# EAGLE schematic Pack Supervisor 97x127mm Rev B (EAGLE 7.2.0)

## Sheet 1 of 2
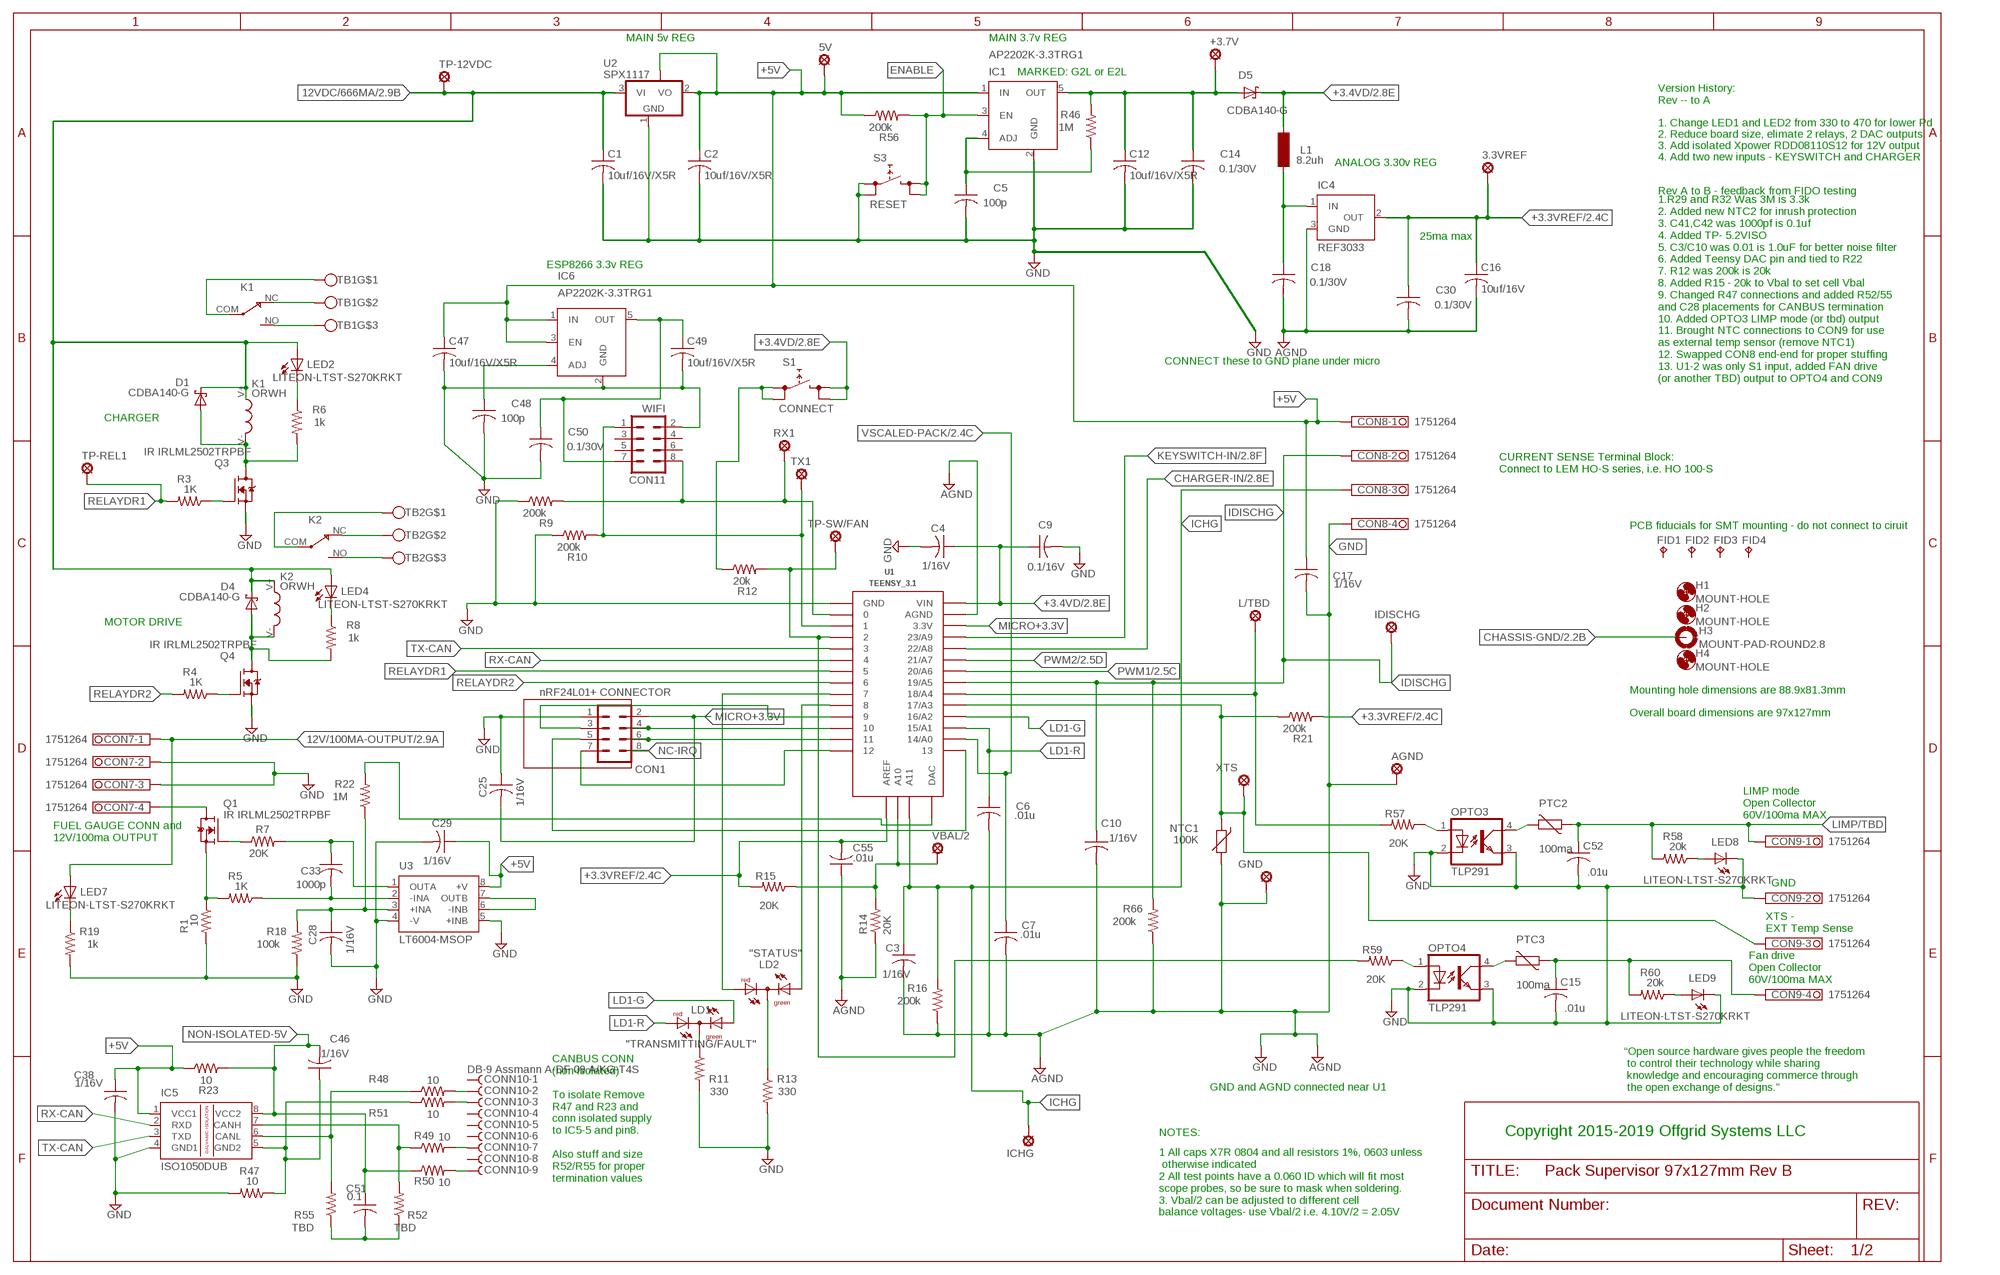
[diagram p0: schematic, sheet 1]

### Parts
3.3VREF  LSP10  [LSP10]
5V  LSP10  [LSP10]
+3.7V  LSP10  [LSP10]
AGND  LSP10  [LSP10]
C1  10uf/16V/X5R  C-USC0805K  [C0805K]
C2  10uf/16V/X5R  C-USC0805K  [C0805K]
C3  1/16V  TIMS_INDUCTOR_C-USC0805  [TIMS_INDUCTOR_C0805]
C4  1/16V  TIMS_INDUCTOR_C-USC0805  [TIMS_INDUCTOR_C0805]
C5  100p  TIMS_INDUCTOR_C-USC0805  [TIMS_INDUCTOR_C0805]
C6  .01u  TIMS_INDUCTOR_C-USC0805  [TIMS_INDUCTOR_C0805]
C7  .01u  TIMS_INDUCTOR_C-USC0805  [TIMS_INDUCTOR_C0805]
C9  0.1/16V  TIMS_INDUCTOR_C-USC0805  [TIMS_INDUCTOR_C0805]
C10  1/16V  TIMS_INDUCTOR_C-USC0805  [TIMS_INDUCTOR_C0805]
C12  10uf/16V/X5R  C-USC0805K  [C0805K]
C14  0.1/30V  TIMS_INDUCTOR_C-USC0805  [TIMS_INDUCTOR_C0805]
C15  .01u  TIMS_INDUCTOR_C-USC0805  [TIMS_INDUCTOR_C0805]
C16  10uf/16V  C-USC0805K  [C0805K]
C17  1/16V  TIMS_INDUCTOR_C-USC0805  [TIMS_INDUCTOR_C0805]
C18  0.1/30V  TIMS_INDUCTOR_C-USC0805  [TIMS_INDUCTOR_C0805]
C25  1/16V  TIMS_INDUCTOR_C-USC0805  [TIMS_INDUCTOR_C0805]
C28  1/16V  TIMS_INDUCTOR_C-USC0805  [TIMS_INDUCTOR_C0805]
C29  1/16V  TIMS_INDUCTOR_C-USC0805  [TIMS_INDUCTOR_C0805]
C30  0.1/30V  TIMS_INDUCTOR_C-USC0805  [TIMS_INDUCTOR_C0805]
C33  1000p  TIMS_INDUCTOR_C-USC0805  [TIMS_INDUCTOR_C0805]
C38  1/16V  TIMS_INDUCTOR_C-USC0805  [TIMS_INDUCTOR_C0805]
C46  1/16V  TIMS_INDUCTOR_C-USC0805  [TIMS_INDUCTOR_C0805]
C47  10uf/16V/X5R  C-USC0805K  [C0805K]
C48  100p  TIMS_INDUCTOR_C-USC0805  [TIMS_INDUCTOR_C0805]
C49  10uf/16V/X5R  C-USC0805K  [C0805K]
C50  0.1/30V  TIMS_INDUCTOR_C-USC0805  [TIMS_INDUCTOR_C0805]
C51  0.1  TIMS_INDUCTOR_C-USC0805  [TIMS_INDUCTOR_C0805]
C52  .01u  TIMS_INDUCTOR_C-USC0805  [TIMS_INDUCTOR_C0805]
C55  .01u  C-USC0805  [C0805]
CON1  nRF24L01+ CONNECTOR  NRF24L01  [NRF24L01]
CON7  1751264  [1751264]
CON8  1751264  [1751264]
CON9  1751264  [1751264]
CON11  WIFI  MA04-2  [MA04-2]
CONN10  DB-9 Assmann A-DF 09 A/KG-T4S  D-SUB9-H5M09RA  [H5M09RA]
D1  CDBA140-G  [DO214AC]
D4  CDBA140-G  [DO214AC]
D5  CDBA140-G  [DO214AC]
FID1  FIDUCIALTP10R  [TP10R]
FID2  FIDUCIALTP10R  [TP10R]
FID3  FIDUCIALTP10R  [TP10R]
FID4  FIDUCIALTP10R  [TP10R]
GND  LSP10  [LSP10]
H1  MOUNT-HOLE  [2,6]
H2  MOUNT-HOLE  [2,6]
H3  MOUNT-PAD-ROUND2.8  [2,8-PAD]
H4  MOUNT-HOLE  [2,6]
IC1  AP2202K-3.3TRG1  MIC5205  [SOT23-5]
IC4  REF3033  MAX6520  [SOT23]
IC5  ISO1050DUB  [DUB-R-PDSO-G8]
IC6  AP2202K-3.3TRG1  MIC5205  [SOT23-5]
ICHG  LSP10  [LSP10]
IDISCHG  LSP10  [LSP10]
K1  ORWH  [ORWH]
K2  ORWH  [ORWH]
L1  8.2uh  SM-1206  [SM-1206]
L/TBD  LSP10  [LSP10]
LD1  "TRANSMITTING/FAULT"  DUOLED-RG-C  [DUOLED-C-5MM]
LD2  "STATUS"  DUOLED-RG-C  [DUOLED-C-5MM]
LED2  LITEON-LTST-S270KRKT  [LITEON-LTST-S270KRKT]
LED4  LITEON-LTST-S270KRKT  [LITEON-LTST-S270KRKT]
LED7  LITEON-LTST-S270KRKT  [LITEON-LTST-S270KRKT]
LED8  LITEON-LTST-S270KRKT  [LITEON-LTST-S270KRKT]
LED9  LITEON-LTST-S270KRKT  [LITEON-LTST-S270KRKT]
NTC1  100K  NTC-MURATA-NCP18WF104J03RB  [0603]
OPTO3  TLP291  TLP283  [MINI-FLAT-4]
OPTO4  TLP291  TLP283  [MINI-FLAT-4]
PTC2  100ma  VARISTORCN0603  [CT/CN0603]
PTC3  100ma  VARISTORCN0603  [CT/CN0603]
Q1  IRLML2502TRPBF  IRLML2060TRPBF  [SOT23]
Q3  IRLML2502TRPBF  IRLML2060TRPBF  [SOT23]
Q4  IRLML2502TRPBF  IRLML2060TRPBF  [SOT23]
R1  10  R-US_R0603  [R0603]
R3  1K  R-US_R0603  [R0603]
R4  1K  R-US_R0603  [R0603]
R5  1K  R-US_R0603  [R0603]
R6  1k  R-US_R0603  [R0603]
R7  20K  R-US_R0603  [R0603]
R8  1k  R-US_R0603  [R0603]
R9  200k  R-US_R0603  [R0603]
R10  200k  R-US_R0603  [R0603]
R11  330  R-US_R0603  [R0603]
R12  20k  R-US_R0603  [R0603]
R13  330  R-US_R0603  [R0603]
R14  20K  R-US_R0603  [R0603]
R15  20K  R-US_R0603  [R0603]
R16  200k  R-US_R0603  [R0603]
R18  100k  R-US_R0603  [R0603]
R19  1k  R-US_R0603  [R0603]
R21  200k  R-US_R0603  [R0603]
R22  1M  R-US_R0603  [R0603]
R23  10  R-US_R0603  [R0603]
R46  1M  R-US_R0603  [R0603]
R47  10  R-US_R0603  [R0603]
R48  10  R-US_R0603  [R0603]
R49  10  R-US_R0603  [R0603]
R50  10  R-US_R0603  [R0603]
R51  10  R-US_R0603  [R0603]
R52  TBD  R-US_0207/5V  [0207/5V]
R55  TBD  R-US_0207/5V  [0207/5V]
R56  200k  R-US_R0603  [R0603]
R57  20K  R-US_R0603  [R0603]
R58  20k  R-US_R0603  [R0603]
R59  20K  R-US_R0603  [R0603]
R60  20k  R-US_R0603  [R0603]
R66  200k  R-US_R0603  [R0603]
RX1  LSP10  [LSP10]
S1  CONNECT  PTS645  [PTS645]
S3  RESET  PTS645  [PTS645]
TB1  TE-5-1437652-4  [TE-5-1437652-4]
TB2  TE-5-1437652-4  [TE-5-1437652-4]
TP-12VDC  LSP10  [LSP10]
TP-REL1  LSP10  [LSP10]
TP-SW/FAN  LSP10  [LSP10]
TX1  LSP10  [LSP10]
U1  TEENSY_3.1  TEENSY_3.0-DIP+ANALOG  [TEENSY_3.0-DIP+ANALOG+DAC]
U2  SPX1117  [SOT223]
U3  LT6004-MSOP  [LT6004-MSOP]
VBAL/2  LSP10  [LSP10]
XTS  LSP10  [LSP10]

### Nets
0-UNUSED: CON11.8 R9.2 RX1.MP U1.0
5V-ESP: C49.1 C50.1 CON11.7 IC6.5(OUT)
12V/100MA-OUTPUT: CON7.1 LED7.ANODE(A) ; also sheet 2
12VDC/666MA: C1.1 D1.C D4.C K1.V+ K2.V+ LED2.ANODE(A) LED4.ANODE(A) TP-12VDC.MP U2.3(VI) ; also sheet 2
+3.3VREF: 3.3VREF.MP C16.1 C30.1 C55.2 IC4.2(OUT) R15.2 R21.2 U1.AREF ; also sheet 2
+3.4VD: C4.1 C9.1 D5.C L1.2 S1.3 S1.4 U1.VIN ; also sheet 2
+3.65VD: +3.7V.MP C12.1 C14.1 D5.A IC1.5(OUT) R46.2
+3.300VA: C18.1 IC4.1(IN) L1.1
+5: CONN10.9 R50.2
+5V: 5V.MP C2.1 C17.1 C29.1 C38.1 C47.1 CON8.1 IC1.1(IN) IC5.1(VCC1) IC6.1(IN) IC6.3(EN) R23.1 R56.1 U2.2(VO) U2.4(TAB) U3.8(+V)
ADC-L3: L/TBD.MP R57.2 U1.18/A4
ADS: D4.A K2.V- Q4.3(D) R8.2
CE: CON1.3 U1.9
CHARGER-IN: U1.22/A8 ; also sheet 2
CHASSIS-GND: H3.B2,8(MOUNT) ; also sheet 2
CHI: CONN10.7 R49.2
CLO: CONN10.2 R48.2
CSN: CON1.4 U1.10
DAC: R22.2 U1.14(DAC)
ENABLE: IC1.3(EN) R56.2 S3.3 S3.4
FAN/TBD: C15.1 CON9.4 PTC3.1 R60.2
FUELGAUGE: CON7.4 Q1.3(D)
G: CONN10.3 R51.2
GND: AGND.MP C1.2 C2.2 C3.2 C4.2 C5.2 C6.2 C7.2 C9.2 C10.2 C12.2 C14.2 C15.2 C16.2 C17.2 C18.2 C25.1 C28.2 C29.2 C30.2 C38.2 C47.2 C48.2 C49.2 C50.2 C52.2 C55.1 CON1.1 CON7.2 CON7.3 CON8.4 CON9.2 CON11.2 GND.MP IC1.2(GND) IC4.3(GND) IC5.4(GND1) IC6.2(GND) LED8.CATHODE(C) LED9.CATHODE(C) NTC1.2 OPTO3.2(C) OPTO3.3(EMIT) OPTO4.2(C) OPTO4.3(EMIT) Q3.2(S) Q4.2(S) R1.2 R9.1 R10.1 R11.2 R13.2 R14.1 R16.1 R18.1 R19.2 R47.2 R66.1 S3.1 S3.2 U1.AGND U1.GND U2.1(GND) U3.4(-V) U3.5(+INB) ; supply symbol labelled AGND ; also sheet 2
ICHG: C3.1 CON8.3 ICHG.MP R16.2 U1.A11
IDISCHG: C10.1 CON8.2 IDISCHG.MP R66.2 U1.19/A5
KEYSWITCH-IN: U1.23/A9 ; also sheet 2
LD1-G: LD1.AX(AG) U1.16/A2
LD1-R: C6.1 LD1.AR U1.15/A1
LIMP/TBD: C52.1 CON9.1 PTC2.1 R58.2
MICRO+3.3V: C25.2 CON1.2 U1.3.3V
MISO: CON1.7 U1.12
MOSI: CON1.6 U1.11
N$1: LED2.CATHODE(C) R6.1
N$3: CON9.3 NTC1.1 R21.1 U1.17/A3 XTS.MP
N$6: IC5.6(CANL) R48.1 R55.2
N$8: K1.NC TB1.2
N$9: D1.A K1.V- Q3.3(D) R6.2
N$10: LD2.C R13.1
N$13: LD2.AX(AG) U1.8
N$14: LD2.AR U1.7
N$18: U3.6(-INB) U3.7(OUTB)
N$19: LD1.C R11.1
N$20: C28.1 R18.2 R22.1 U3.3(+INA)
N$21: Q3.1(G) R3.1
N$22: IC5.7(CANH) R49.1 R52.2
N$23: Q4.1(G) R4.1
N$25: C33.1 R7.2 U3.1(OUTA)
N$26: C5.1 IC1.4(ADJ) R46.1
N$27: Q1.1(G) R7.1
N$28: Q1.2(S) R1.1 R5.2
N$30: K1.NO TB1.3
N$31: K1.COM TB1.1
N$35: K2.COM TB2.1
N$36: K2.NC TB2.2
N$37: C33.2 R5.1 U3.2(-INA)
N$39: K2.NO TB2.3
N$48: LED4.CATHODE(C) R8.1
N$51: C46.1 IC5.5(GND2) R47.1 R51.1
N$53: R12.2 R59.2 TP-SW/FAN.MP U1.2
N$59: C51.2 R52.1 R55.1
N$61: CON11.1 R10.2 TX1.MP U1.1
N$62: LED7.CATHODE(C) R19.1
N$63: C48.1 IC6.4(ADJ)
N$66: LED8.ANODE(A) R58.1
N$67: OPTO3.1(A) R57.1
N$68: OPTO3.4(COL) PTC2.2
N$69: LED9.ANODE(A) R60.1
N$70: OPTO4.1(A) R59.1
N$71: OPTO4.4(COL) PTC3.2
N$72: R12.1 S1.1 S1.2
NC-IRQ: CON1.8
NON-ISOLATED-5V: C46.2 C51.1 IC5.8(VCC2) R23.2 R50.1
PWM1: U1.20/A6 ; also sheet 2
PWM2: U1.21/A7 ; also sheet 2
RELAYDR1: R3.2 TP-REL1.MP U1.5
RELAYDR2: R4.2 U1.6
RX-CAN: IC5.2(RXD) U1.4
SCK: CON1.5 U1.13
TX-CAN: IC5.3(TXD) U1.3
VBAL: R14.2 R15.1 U1.A10 VBAL/2.MP
VSCALED-PACK: C7.1 U1.14/A0 ; also sheet 2
Unconnected: CON11.3 CON11.4 CON11.5 CON11.6 CONN10.1 CONN10.4 CONN10.5 CONN10.6 CONN10.8 FID1.TP FID2.TP FID3.TP FID4.TP

### Notes on the sheet
- MAIN 5v REG | MAIN 3.7v REG
- MARKED: G2L or E2L
- Version History:
  Rev -- to A
- 1. Change LED1 and LED2 from 330 to 470 for lower Pd
- 2. Reduce board size, elimate 2 relays, 2 DAC outputs
- 3. Add isolated Xpower RDD08110S12 for 12V output
- 4. Add two new inputs - KEYSWITCH and CHARGER
- ANALOG 3.30v REG
- Rev A to B - feedback from FIDO testing
- 25ma max
- ESP8266 3.3v REG
- CONNECT these to GND plane under micro
- 1.R29 and R32 Was 3M is 3.3k
  2. Added new NTC2 for inrush protection
  3. C41,C42 was 1000pf is 0.1uf
  4. Added TP- 5.2VISO
  5. C3/C10 was 0.01 is 1.0uF for better noise filter
  6. Added Teensy DAC pin and tied to R22
  7. R12 was 200k is 20k
  8. Added R15 - 20k to Vbal to set cell Vbal
  9. Changed R47 connections and added R52/55 
  and C28 placements for CANBUS termination
  10. Added OPTO3 LIMP mode (or tbd) output
  11. Brought NTC connections to CON9 for use 
  as external temp sensor (remove NTC1)
  12. Swapped CON8 end-end for proper stuffing
  13. U1-2 was only S1 input, added FAN drive
  (or another TBD) output to OPTO4 and CON9
- CHARGER
- CURRENT SENSE Terminal Block:
  Connect to LEM HO-S series, i.e. HO 100-S
- PCB fiducials for SMT mounting - do not connect to ciruit
- MOTOR DRIVE
- Mounting hole dimensions are 88.9x81.3mm
- Overall board dimensions are 97x127mm
- LIMP mode
  Open Collector
  60V/100ma MAX
- FUEL GAUGE CONN and
  12V/100ma OUTPUT
- GND
- XTS -
  EXT Temp Sense
- Fan drive
  Open Collector
  60V/100ma MAX
- GND and AGND connected near U1
- “Open source hardware gives people the freedom
   to control their technology while sharing
   knowledge and encouraging commerce through
   the open exchange of designs.”
- NOTES: | Copyright 2015-2019 Offgrid Systems LLC
- CANBUS CONN
  (non-isolated) 
  
  To isolate Remove
  R47 and R23 and
  conn isolated supply
  to IC5-5 and pin8.
  
  Also stuff and size
  R52/R55 for proper
  termination values
- 1 All caps X7R 0804 and all resistors 1%, 0603 unless
   otherwise indicated
  2 All test points have a 0.060 ID which will fit most 
  scope probes, so be sure to mask when soldering.
  3. Vbal/2 can be adjusted to different cell 
  balance voltages- use Vbal/2 i.e. 4.10V/2 = 2.05V

## Sheet 2 of 2
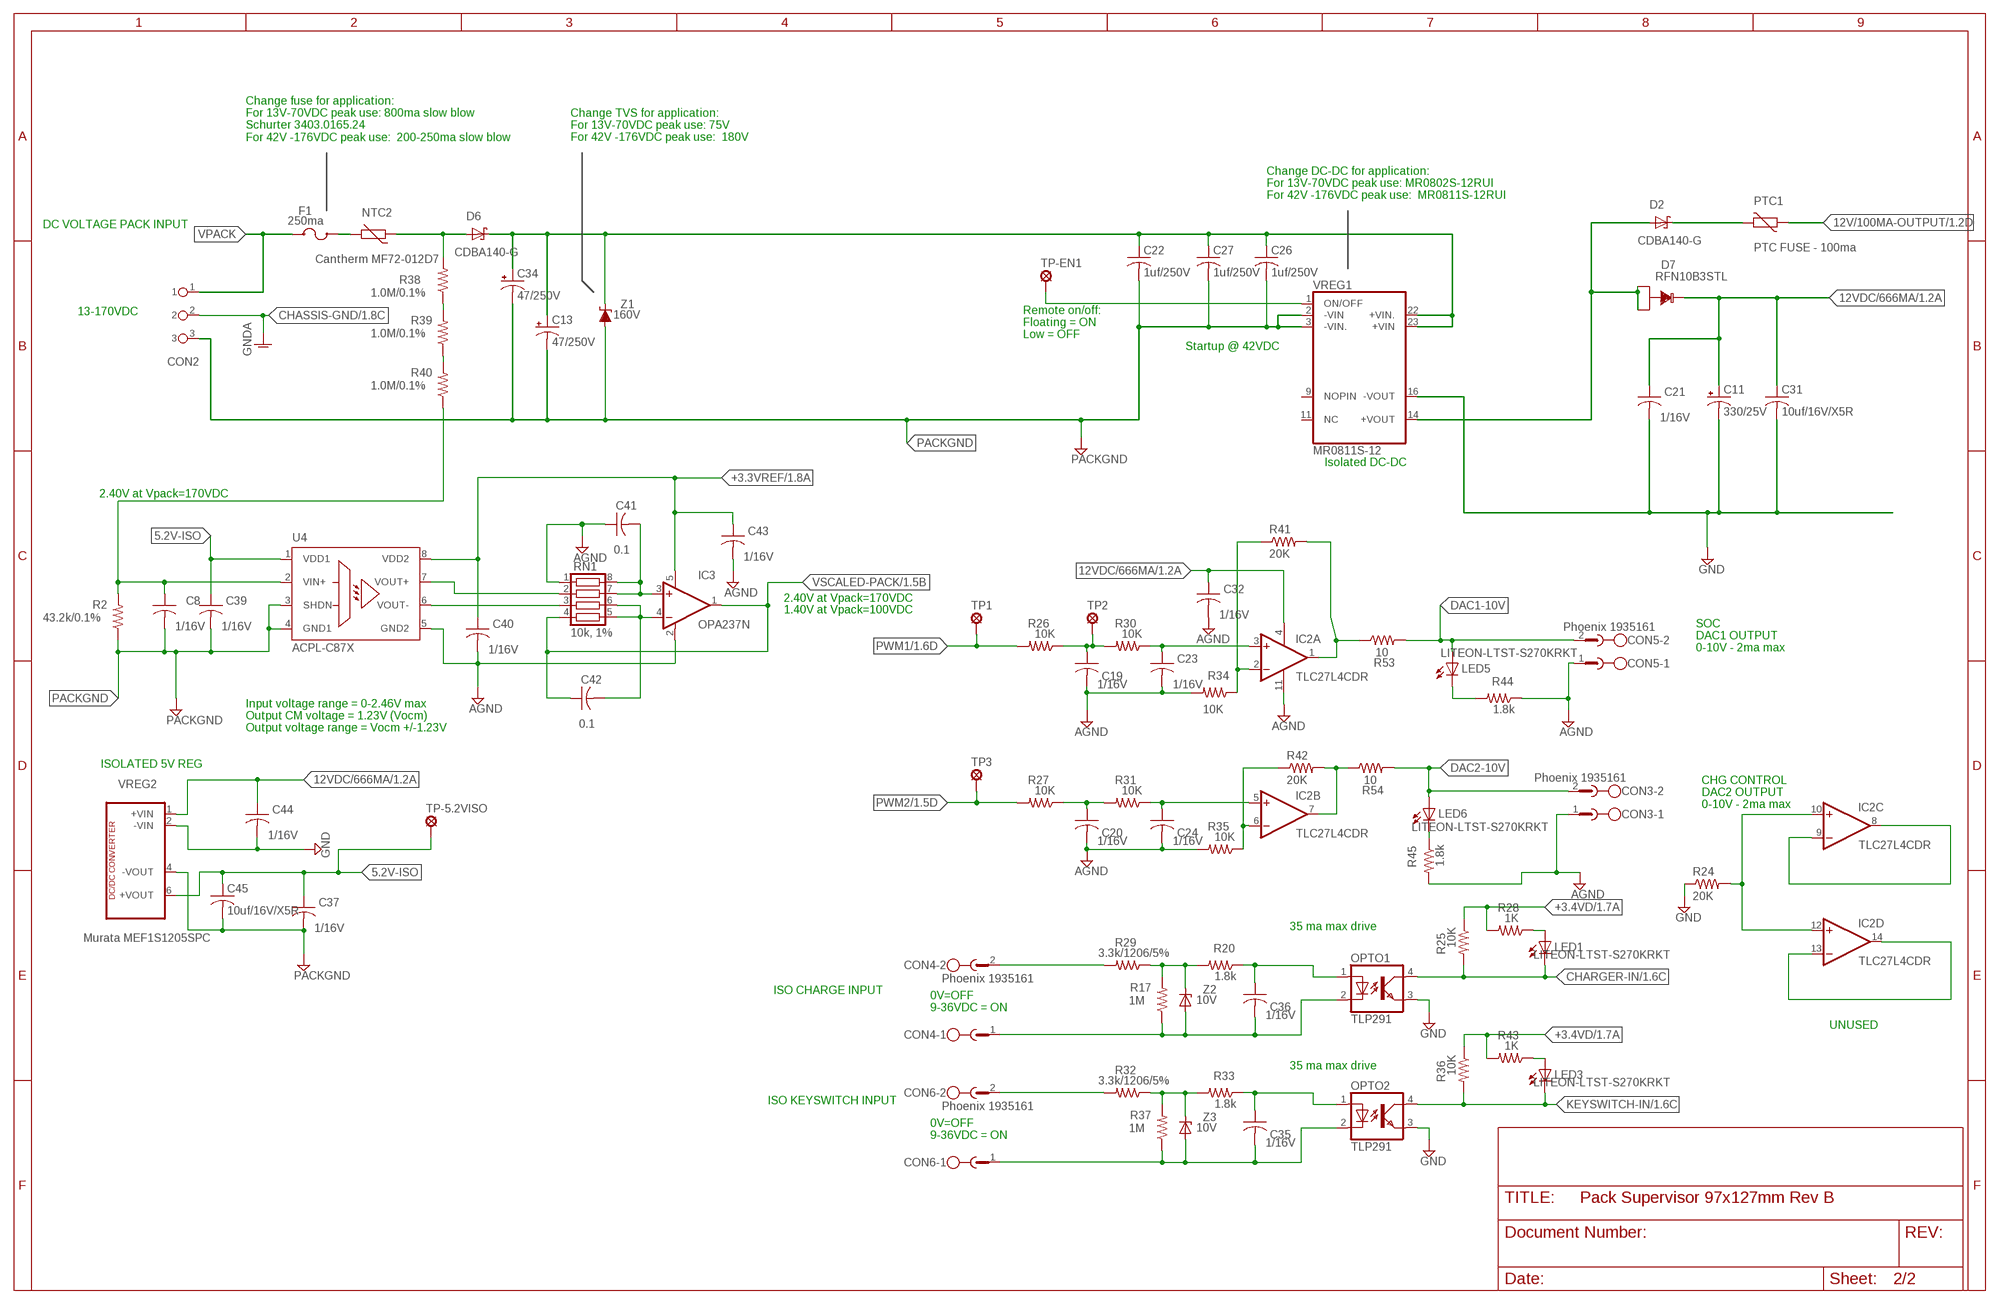
[diagram p1: schematic, sheet 2]

### Parts
C8  1/16V  TIMS_INDUCTOR_C-USC0805  [TIMS_INDUCTOR_C0805]
C11  330/25V  CPOL-USE5-10.5  [E5-10,5]
C13  47/250V  CPOL-USE5-13  [E5-13]
C19  1/16V  TIMS_INDUCTOR_C-USC0805  [TIMS_INDUCTOR_C0805]
C20  1/16V  TIMS_INDUCTOR_C-USC0805  [TIMS_INDUCTOR_C0805]
C21  1/16V  TIMS_INDUCTOR_C-USC0805  [TIMS_INDUCTOR_C0805]
C22  1uf/250V  RCL_C-US050-030X075  [RCL_C050-030X075]
C23  1/16V  TIMS_INDUCTOR_C-USC0805  [TIMS_INDUCTOR_C0805]
C24  1/16V  TIMS_INDUCTOR_C-USC0805  [TIMS_INDUCTOR_C0805]
C26  1uf/250V  RCL_C-US050-030X075  [RCL_C050-030X075]
C27  1uf/250V  RCL_C-US050-030X075  [RCL_C050-030X075]
C31  10uf/16V/X5R  C-USC0805K  [C0805K]
C32  1/16V  TIMS_INDUCTOR_C-USC0805  [TIMS_INDUCTOR_C0805]
C34  47/250V  CPOL-USE5-13  [E5-13]
C35  1/16V  TIMS_INDUCTOR_C-USC0805  [TIMS_INDUCTOR_C0805]
C36  1/16V  TIMS_INDUCTOR_C-USC0805  [TIMS_INDUCTOR_C0805]
C37  1/16V  TIMS_INDUCTOR_C-USC0805  [TIMS_INDUCTOR_C0805]
C39  1/16V  TIMS_INDUCTOR_C-USC0805  [TIMS_INDUCTOR_C0805]
C40  1/16V  TIMS_INDUCTOR_C-USC0805  [TIMS_INDUCTOR_C0805]
C41  0.1  TIMS_INDUCTOR_C-USC0805  [TIMS_INDUCTOR_C0805]
C42  0.1  TIMS_INDUCTOR_C-USC0805  [TIMS_INDUCTOR_C0805]
C43  1/16V  TIMS_INDUCTOR_C-USC0805  [TIMS_INDUCTOR_C0805]
C44  1/16V  TIMS_INDUCTOR_C-USC0805  [TIMS_INDUCTOR_C0805]
C45  10uf/16V/X5R  C-USC0805K  [C0805K]
CON2  TYCO-796739-3  [TYCO-796739-3]
CON3  Phoenix 1935161  MSTBV2  [MSTBV2]
CON4  Phoenix 1935161  MSTBV2  [MSTBV2]
CON5  Phoenix 1935161  MSTBV2  [MSTBV2]
CON6  Phoenix 1935161  MSTBV2  [MSTBV2]
D2  CDBA140-G  [DO214AC]
D6  CDBA140-G  [DO214AC]
D7  RFN10B3STL  [TO252-FATPADS]
F1  250ma  SCHURTER-UMT250  [SCHURTER-UMT250]
IC2  TLC27L4CDR  OPA4134UA  [SO14]
IC3  OPA237N  [SOT23-5]
LED1  LITEON-LTST-S270KRKT  [LITEON-LTST-S270KRKT]
LED3  LITEON-LTST-S270KRKT  [LITEON-LTST-S270KRKT]
LED5  LITEON-LTST-S270KRKT  [LITEON-LTST-S270KRKT]
LED6  LITEON-LTST-S270KRKT  [LITEON-LTST-S270KRKT]
NTC2  Cantherm MF72-012D7  NTC-GLASS  [D7-PACKAGE]
OPTO1  TLP291  TLP283  [MINI-FLAT-4]
OPTO2  TLP291  TLP283  [MINI-FLAT-4]
PTC1  PTC FUSE - 100ma  VARISTORCN0603  [CT/CN0603]
R2  43.2k/0.1%  R-US_R0603  [R0603]
R17  1M  R-US_R0603  [R0603]
R20  1.8k  R-US_R0603  [R0603]
R24  20K  R-US_R0603  [R0603]
R25  10K  R-US_R0603  [R0603]
R26  10K  R-US_R0603  [R0603]
R27  10K  R-US_R0603  [R0603]
R28  1K  R-US_R0603  [R0603]
R29  3.3k/1206/5%  R-US_R1206  [R1206]
R30  10K  R-US_R0603  [R0603]
R31  10K  R-US_R0603  [R0603]
R32  3.3k/1206/5%  R-US_R1206  [R1206]
R33  1.8k  R-US_R0603  [R0603]
R34  10K  R-US_R0603  [R0603]
R35  10K  R-US_R0603  [R0603]
R36  10K  R-US_R0603  [R0603]
R37  1M  R-US_R0603  [R0603]
R38  1.0M/0.1%  R-US_R0805  [R0805]
R39  1.0M/0.1%  R-US_R0805  [R0805]
R40  1.0M/0.1%  R-US_R0805  [R0805]
R41  20K  R-US_R0603  [R0603]
R42  20K  R-US_R0603  [R0603]
R43  1K  R-US_R0603  [R0603]
R44  1.8k  R-US_R0603  [R0603]
R45  1.8k  R-US_R0603  [R0603]
R53  10  R-US_R0603  [R0603]
R54  10  R-US_R0603  [R0603]
RN1  10k, 1%  CTS742C083  [CTS742C083]
TP1  LSP10  [LSP10]
TP2  LSP10  [LSP10]
TP3  LSP10  [LSP10]
TP-5.2VISO  LSP10  [LSP10]
TP-EN1  LSP10  [LSP10]
U4  ACPL-C87X  [STRETCH-SO8]
VREG1  MR0811S-12  [MR0811S-12]
VREG2  Murata MEF1S1205SPC  MURATA-MEF-ISODCDC  [MURATA-MEF]
Z1  160V  ZENER-SMB  [SMB]
Z2  10V  TIMS_DIODE_ZENER-DIODESOT23  [TIMS_DIODE_SOT23]
Z3  10V  TIMS_DIODE_ZENER-DIODESOT23  [TIMS_DIODE_SOT23]

### Nets
5.2V-ISO: C37.1 C39.1 C45.1 TP-5.2VISO.MP U4.1(VDD1) VREG2.6(+VOUT)
12V/100MA-OUTPUT: PTC1.1 ; also sheet 1
12VDC/666MA: C11.+ C21.1 C31.1 C32.1 C44.1 D7.DRAIN(CATHODE) IC2.4(P:V+) VREG2.1(+VIN) ; also sheet 1
+3.3VREF: C40.1 C43.1 IC3.5(V+) U4.8(VDD2) ; also sheet 1
+3.4VD: R25.1 R28.2 R36.1 R43.2 ; also sheet 1
ASDF: IC2.1(A:OUT) R41.2 R53.1
CHARGER-IN: LED1.CATHODE(C) OPTO1.4(COL) R25.2 ; also sheet 1
CHASSIS-GND: CON2.2 ; supply symbol labelled GNDA ; also sheet 1
CHGINLO: C36.2 CON4.1 OPTO1.2(C) R17.1 Z2.1(A)
DAC1-10V: CON5.2 LED5.ANODE(A) R53.2
DAC2-10V: CON3.2 LED6.ANODE(A) R54.2
GND: C11.- C19.2 C20.2 C21.2 C23.2 C24.2 C31.2 C32.2 C40.2 C41.1 C43.2 C44.2 CON3.1 CON5.1 IC2.11(P:V-) IC3.2(V-) OPTO1.3(EMIT) OPTO2.3(EMIT) R24.1 R34.2 R35.2 R44.1 R45.2 RN1.1 U4.5(GND2) VREG1.16(-VOUT) VREG2.2(-VIN) ; supply symbol labelled AGND ; also sheet 1
KEYSWINLO: C35.2 CON6.1 OPTO2.2(C) R37.1 Z3.1(A)
KEYSWITCH-IN: LED3.CATHODE(C) OPTO2.4(COL) R36.2 ; also sheet 1
N$2: IC2.7(B:OUT) R42.2 R54.1
N$4: R38.1 R39.2
N$5: R39.1 R40.2
N$7: F1.P$1(1A) NTC2.2
N$11: IC2.2(A:-IN) R34.1 R41.1
N$15: C23.1 IC2.3(A:+IN) R30.1
N$16: CON4.2 R29.2
N$17: TP-EN1.MP VREG1.1(ON/OFF)
N$24: C36.1 OPTO1.1(A) R20.1
N$29: R17.2 R20.2 R29.1 Z2.3(C)
N$32: IC2.6(B:-IN) R35.1 R42.1
N$33: C24.1 IC2.5(B:+IN) R31.1
N$34: C20.1 R27.1 R31.2
N$38: IC2.8(C:OUT) IC2.9(C:-IN)
N$40: IC2.13(D:-IN) IC2.14(D:OUT)
N$41: IC2.10(C:+IN) IC2.12(D:+IN) R24.2
N$42: LED1.ANODE(A) R28.1
N$43: C35.1 OPTO2.1(A) R33.1
N$44: R32.1 R33.2 R37.2 Z3.3(C)
N$45: LED3.ANODE(A) R43.1
N$46: D2.C PTC1.2
N$47: C19.1 R26.1 R30.2 TP2.MP
N$49: LED5.CATHODE(C) R44.2
N$50: LED6.CATHODE(C) R45.1
N$52: C8.1 R2.2 R40.1 U4.2(VIN+)
N$54: D2.A D7.GATE(ANODE1) D7.SOURCE(ANODE2) VREG1.14(+VOUT)
N$55: RN1.2 U4.7(VOUT+)
N$56: RN1.3 U4.6(VOUT-)
N$57: C42.2 IC3.4(-IN) RN1.5 RN1.6
N$58: C41.2 IC3.3(+IN) RN1.7 RN1.8
N$64: CON6.2 R32.2
PACKGND: C8.2 C13.- C22.2 C26.2 C27.2 C34.- C37.2 C39.2 C45.2 CON2.3 R2.1 U4.3(SHDN) U4.4(GND1) VREG1.2(-VIN) VREG1.3(-VIN.) VREG2.4(-VOUT) Z1.A
PWM1: R26.2 TP1.MP ; also sheet 1
PWM2: R27.2 TP3.MP ; also sheet 1
TPF1A: D6.A NTC2.1 R38.2
VIN: C13.+ C22.1 C26.1 C27.1 C34.+ D6.C VREG1.22(+VIN.) VREG1.23(+VIN) Z1.C
VPACK: CON2.1 F1.P$2(2A)
VSCALED-PACK: C42.1 IC3.1(OUT) RN1.4 ; also sheet 1
Unconnected: VREG1.9(NOPIN) VREG1.11(NC)

### Notes on the sheet
- Change fuse for application:
  For 13V-70VDC peak use: 800ma slow blow
  Schurter 3403.0165.24
  For 42V -176VDC peak use:  200-250ma slow blow
- Change TVS for application:
  For 13V-70VDC peak use: 75V
  For 42V -176VDC peak use:  180V
- Change DC-DC for application:
  For 13V-70VDC peak use: MR0802S-12RUI
  For 42V -176VDC peak use:  MR0811S-12RUI
- DC VOLTAGE PACK INPUT
- 13-170VDC
- Remote on/off:
  Floating = ON
  Low = OFF
- Startup @ 42VDC
- Isolated DC-DC
- 2.40V at Vpack=170VDC
- 2.40V at Vpack=170VDC
- 1.40V at Vpack=100VDC
- SOC
  DAC1 OUTPUT
  0-10V - 2ma max
- Input voltage range = 0-2.46V max
  Output CM voltage = 1.23V (Vocm)
  Output voltage range = Vocm +/-1.23V
- ISOLATED 5V REG
- CHG CONTROL 
  DAC2 OUTPUT
  0-10V - 2ma max
- 35 ma max drive
- ISO CHARGE INPUT
- 0V=OFF
  9-36VDC = ON
- UNUSED
- 35 ma max drive
- ISO KEYSWITCH INPUT
- 0V=OFF
  9-36VDC = ON

## Library data of the parts
3.3VREF 5V +3.7V AGND GND ICHG IDISCHG L/TBD RX1 TP1-TP3 TP-5.2VISO TP-12VDC TP-EN1 TP-REL1 TP-SW/FAN TX1 VBAL/2 XTS = solpad:LSP10: SOLDER PAD drill 1.0 mm, distributor Buerklin, 12H555
C1 C2 C12 C31 C45 C47 C49 = offgrid rcl:C-US: CAPACITOR, American symbol; 100PCPRICE: .062; 1KPRICE: .042; MPN: Murata GRM21BR61C106ME15L
C3 = Power_board:TIMS_INDUCTOR_C-US: CAPACITOR, American symbol; 100PCPRICE: .015; 1KPRICE: .008; MPN: Kemet C0805C103K5RACTU
C4 C8 C17 C19-C21 C23-C25 C28 C29 C32 C33 C35-C44 C46 C51 = Power_board:TIMS_INDUCTOR_C-US: CAPACITOR, American symbol; 100PCPRICE: .04; 1KPRICE: .022; MPN: Kemet C0805C105K4RACTU
C5 C14 C18 C30 C48 C50 = Power_board:TIMS_INDUCTOR_C-US: CAPACITOR, American symbol; MPN: Kemet C0805C104K5RACTU
C6 C7 C10 C15 C52 = Power_board:TIMS_INDUCTOR_C-US: CAPACITOR, American symbol; MPN: Kemet C0805C103K5RACTU
C9 = Power_board:TIMS_INDUCTOR_C-US: CAPACITOR, American symbol; 100PCPRICE: .022; 1KPRICE: .012; MPN: Kemet C0805C104K5RACTU
C11 = offgrid rcl:CPOL-US: POLARIZED CAPACITOR, American symbol
C13 C34 = offgrid rcl:CPOL-US: POLARIZED CAPACITOR, American symbol; 100PCPRICE: .508; 1KPRICE: .339; MPN: PANASONIC ECA-2EM470
C16 = offgrid rcl:C-US: CAPACITOR, American symbol; 1KPRICE: .271; MPN: Murata GRM21BR61A476ME15L
C22 C26 C27 = Offgrid Wheele control PCB:RCL_C-US: CAPACITOR, American symbol
C55 = offgrid rcl:C-US: CAPACITOR, American symbol; MPN: Welwyn PCF0603R-3K01BT1
CON1 = con-lstb:NRF24L01: Nordic 2.4Mhz transceiver NRF24L01+; 100PCPRICE: .53; 1KPRICE: .38
CON2 = offgrid con-wago-500:TYCO-796739-3: Tyco Buchanan terminal block PCB mount Side wire entry 30A 600V 9.52 mm pitch
CON3-CON6 = offgrid con-phoenix-508:MSTBV2: PHOENIX; 100PCPRICE: .327; 10PCPRICE: .352; MPN: Phoenix 1935161
CON7-CON9 = misc:1751264: MKDS 1/ 4-3,5 Phoenix Connector Current: 10 A Rated Voltage: 160 V Pitch: 3,5 mm Contacts: 4 Source: http://eshop.phoenixcontact.com .. 1751264.pdf; MPN: 1751264; OC_FARNELL: unknown; OC_NEWARK: 10R0934
CON11 = con-lstb:MA04-2: PIN HEADER; 100PCPRICE: .528; 10PCPRICE: .713; MPN: Sullins PPPC042LFBN-RC; OC_FARNELL: unknown; OC_NEWARK: unknown
CONN10 = con-thomas-betts:D-SUB9-: D-Subminiatur Connector Source: Electronioc Interconnects European Edition 1998; 100PCPRICE: .563; 10PCPRICE: .735; MPN: ASSMANN A-DS 09 A/KG-T4S; OC_FARNELL: unknown; OC_NEWARK: unknown
D1 D2 D4-D6 = offgrid diode:CDBA140-G: Comchip CDBA140-G DIODE SCHOTTKY 40V 1A DO214AC; 100PCPRICE: .187; 1KPRICE: .068; MPN: comchip CDBA140-G
D7 = offgrid_transistor-fet:RFN10B3STL: Rohm RFN10B3STL Super fast recovery diode DIODE GEN PURP 350V 10A Dpak dpack; 100PCPRICE: .63; 1KPRICE: .387; MPN: ROHM RFN10B3STL
F1 = Leader Power supply 50W-100W parts library:SCHURTER-UMT250: Surface Mount Fuse, 10.1 x 3 mm, Time-Lag T, 250 VAC, 125 VDC; 100PCPRICE: .51; 1KPRICE: .44; ALT-MPN: Schurter 3403.0160; MPN: Schurter 3403.0159.24
FID1-FID4 = offgrid testpad:FIDUCIAL: Fiducial pad - B1,27
H1 = holes:MOUNT-HOLE: MOUNTING HOLE with drill center marker; 100PCPRICE: .324; MPN: Keystone 9056
H2 H4 = holes:MOUNT-HOLE: MOUNTING HOLE with drill center marker
H3 = holes:MOUNT-PAD-ROUND: MOUNTING PAD, round
IC1 IC6 = offgrid v-reg-micrel:MIC5205: VOLTAGE REGULATOR; 100PCPRICE: .23; 1KPRICE: .103; MF: Diodes INc; MPN: Diodes AP2202K-3.3TRG1; OC_FARNELL: 1100656; OC_NEWARK: 09J8939
IC2 = offgrid linear:OPA4*: Quad Operational Amplifier compatible with: TLC27L4 Low Power, Single-Supply, Rail-To-Rail Operational Amplifier Source: http://focus.ti.com/lit/ds/symlink/opa2345.pdf http://focus.ti.com .. opa241.pdf http://focus.ti.com .. tlc27l4.pdf http://focus.ti.com/lit/ds/symlink/opa2134.pdf; 100PCPRICE: .581; 1KPRICE: .39; MPN: TI TLC27L4CDR
IC3 = offgrid burr-brown:OPA237: Operational Amplifiers Single-Supply, MicroAmplifier(TM) Series; 100PCPRICE: 1.0665; MPN: TI OPA237NA/3K
IC4 = maxim:MAX6520: 1.2V Voltage Reference 50ppm/°C, SOT23, 3-Terminal Source: Data sheet <http://datasheets.maxim-ic.com/en/ds/MAX6520.pdf>; 100PCPRICE: 1.25; MPN: TI REF3033AIDBZR; OC_FARNELL: unknown
IC5 = texas:ISO1050: ISOLATED CAN TRANSCEIVER Source: http://focus.ti.com/lit/ds/symlink/iso1050.pdf; 100PCPRICE: 3.43; 10PCPRICE: 4.19; MPN: TI ISO1050DUBR; OC_NEWARK: 14R9899
K1 K2 = offgrid relay:ORWH: 10 amp Miniature PCB Relay ORWH 277V 28VDC $0.68/100; 100PCPRICE: .653; 1KPRICE: .604; MPN: TE 1461069-5
L1 = offgrid-inductor-neosid:SM-1206: INDUCTOR SMD chip inductor; 100PCPRICE: .136; 1KPRICE: .10; MPN: Abracon AIML-1206-8R2K-T
LD1 = led:DUOLED-RG-C: DUO LED 2 colors (red/green), 5 mm, round, common Cathode www.ligitek.com or other producers.; MPN: Kingbright WP59EGC
LD2 = led:DUOLED-RG-C: DUO LED 2 colors (red/green), 5 mm, round, common Cathode www.ligitek.com or other producers.; 100PCPRICE: .18; 1KPRICE: .117; MPN: Kingbright WP59EGC
LED1 LED3-LED6 LED8 LED9 = offgrid led:LITEON-LTST-S270KRKT: LITEON-LTST-S270KRKT side looking SMT on a slightly smaller than 0805 pad; 100PCPRICE: .14; 1KPRICE: .067; MPN: LiteOn LTST-S270KSKT
LED2 LED7 = offgrid led:LITEON-LTST-S270KRKT: LITEON-LTST-S270KRKT side looking SMT on a slightly smaller than 0805 pad; 100PCPRICE: .103; 1KPRICE: .0486; MPN: LiteOn LTST-S270KSKT
NTC1 = offgrid varistor:NTC-MURATA-NCP18WF104J03RB: Murata NCP18WF104J03RB 100K NTC 5%; 100PCPRICE: .106; 1KPRICE: .07999; MPN: MURATA NCP18WF104J03RB
NTC2 = offgrid varistor:NTC-GLASS: NTC thermistor with hermetic sealed glass package in DO-41 style axial package
OPTO1-OPTO4 = optocoupler:TLP283: TOSHIBA PHOTOCOUPLER GaAs IRED & PHOTO-TRANSISTOR Source: http://www.semicon.toshiba.co.jp/td/en/Opto/Photocoupler/en_20050928_TLP283_datasheet.pdf
PTC1-PTC3 = offgrid varistor:VARISTOR: VARISTOR; 100PCPRICE: .112; MPN: Bel Fuse 0ZCM0010FF2G
Q1 Q3 Q4 = offgrid transistor-fet:IRLML2060TRPBF: IR IRLML2060TRPbF low cost MOSFET in SOT23, 1.5A, 500mohm N channel 60V; 100PCPRICE: .144; 1KPRICE: .11; MPN: IR IRLML2502TRPBF
R1 R23 R47-R51 R53 R54 = rcl:R-US_: RESISTOR, American symbol; 100PCPRICE: .018; 1KPRICE: .008; MPN: Bourns CR0603-FX-10R0ELF
R2 = rcl:R-US_: RESISTOR, American symbol; 100PCPRICE: .1924; 1KPRICE: .0769; MPN: Panasonic ERA-3AEB4322V
R3-R5 R28 R43 R58 R60 = rcl:R-US_: RESISTOR, American symbol; 100PCPRICE: .018; 1KPRICE: .0084; MPN: Bourns CR0603-FX-1001ELF
R6 R8 R11 R13 R19 = rcl:R-US_: RESISTOR, American symbol; 100PCPRICE: .0187; 1KPRICE: .0084; MPN: Bourns CR0603-FX-3300ELF
R7 R14 R15 R24 R41 R42 R57 R59 = rcl:R-US_: RESISTOR, American symbol; 100PCPRICE: .018; 1KPRICE: .007; MPN: Bourns CR0603-FX-2002ELF
R9 R10 R12 R21 R56 = rcl:R-US_: RESISTOR, American symbol; 100PCPRICE: .018; 1KPRICE: .007; MPN: Bourns CR0603-FX-2003ELF
R16 R66 = rcl:R-US_: RESISTOR, American symbol; 100PCPRICE: .18; 1KPRICE: .07; MPN: Bourns CR0603-FX-2003ELF
R17 R22 R37 R46 = rcl:R-US_: RESISTOR, American symbol; 100PCPRICE: .0187; 1KPRICE: .0084; MPN: Bourns CR0603-FX-1004ELF
R18 = rcl:R-US_: RESISTOR, American symbol; 100PCPRICE: .018; 1KPRICE: .008; MPN: Bourns CR0603-FX-1003ELF
R20 R33 R44 R45 = rcl:R-US_: RESISTOR, American symbol; 100PCPRICE: .0187; 1KPRICE: .0084; MPN: Bourns CR0603-FX-1821ELF
R25-R27 R30 R31 R34-R36 = rcl:R-US_: RESISTOR, American symbol; 100PCPRICE: .018; 1KPRICE: .0084; MPN: Bourns CR0603-FX-1002ELF
R29 R32 = rcl:R-US_: RESISTOR, American symbol; 100PCPRICE: .021; 1KPRICE: .0076; MPN: Panasonic ERJ-8GEYJ305V
R38-R40 = rcl:R-US_: RESISTOR, American symbol; 100PCPRICE: .192; 1KPRICE: .076; MPN: Panasonic ERA-6AEB105V
R52 R55 = offgrid resistor:R-US_: RESISTOR, American symbol
RN1 = offgrid resistor-net:CTS742C083: Chip Resistor Array 4 Single Resistor Source: http://www.ctscorp.com/components/Datasheets/CTSChipArrayDs.pdf; 100PCPRICE: .05; MPN: Yageo TC164-FR-0710KL
S1 S3 = offgrid switch:PTS645; 100PCPRICE: 0.176; 1KPRICE: 0.11; MPN: C&k PTS645SM43SMTR92 LFS
TB1 TB2 = offgrid con-wago-500:TE-5-1437652-4: TE connectivity TE-5-1437652-4 buchannan CONN BARRIER STRIP 3 screw .375 on center 15A 300V; 100PCPRICE: 1.16; 1KPRICE: .84; MPN: TE 5-1437652-4
U1 = Teensy3.0v1.1:TEENSY_3.0-DIP+ANALOG: Teensy 3.0, 3.1 PCB layout with 0.043 holes for .025sq pins; 1KPRICE: 9.99; LOPROFILE-PINHEADER: Millmax 800-10-045-10-002000; LOPROFILE-SOCKET: Precidip 315-87-160-41-003101; MATCHING-SOCKET: 3M 929850-01-13-RA; MPN: OshPark Teensy 3.1; PIN-HEADER: TE Conn 1-644456-3
U2 = offgrid linear2:SPX1117: Exar SPX1117 positive LDO regulator low drop with 750ma output and 5V in SOT-223 or SOT223 (M3) voltage regulator with TAB connected to Vout; 100PCPRICE: .286; 1KPRICE: .162; MPN: Exar SPX1117M3-L-5-0/TR
U3 = Leader Power supply 50W-100W parts library:LT6004-MSOP: LT6003/LT6004/LT6005 1.6V, 1µA Precision Rail-to-Rail Input and Output Op Amps The LT®6003/LT6004/LT6005 are single/dual/quad op amps designed to maximize battery life and performance for portable applications. These amplifiers operate on supplies as low as 1.6V and are fully specified and guaranteed over temperature on 1.8V, 5V and ±8V supp; 100PCPRICE: 1.30; MPN: LTC LT6004CMS8
U4 = offgrid avago:ACPL-C87X: ACPL-C87B, ACPL-C87A, ACPL-C870 Precision Optically Isolated Voltage Sensor Data in Stretched SO-8 package; 100PCPRICE: 5.71; MPN: Avago Broadcomm ACPL-C87B-000E
VREG1 = offgrid linear:MR0811S-12: Micropower Direct Isolated DC-DC converter Ultrawide input , 8W compact DIP Railway series MR08xxRUI, various input and output versions, this one is single output, there are dual output versions too.; 100PCPRICE: 23.20; 10PCPRICE: 27.40; 1KPRICE: 21.10; MPN: Micropower Direct MR0811S-12RUI
VREG2 = offgrid dc-dc-converter:MURATA-MEF-ISODCDC: Murata SIP DC-DC isolated converter Series MEF 4 pin 0.1in centers 5V output, 12V or 5V input 70% efficiency Under 5 bucks; 100PCPRICE: 4.60; 10PCPRICE: 5.02; MPN: Murata MEF1S1205SPC
Z1 = Leader Power supply 50W-100W parts library:ZENER-SMB: Zener diode in SMB package; 100PCPRICE: .218; MPN: ON SEMI 1SMB5954BT3G
Z2 Z3 = Power_board - Copy:TIMS_DIODE_ZENER-DIODE: Z-Diode; 100PCPRICE: .084; MPN: ON SEMI SZBZX84C10LT1G